# EAGLE schematic yusynth_vco (EAGLE 9.6.2)

## Sheet 1 of 5
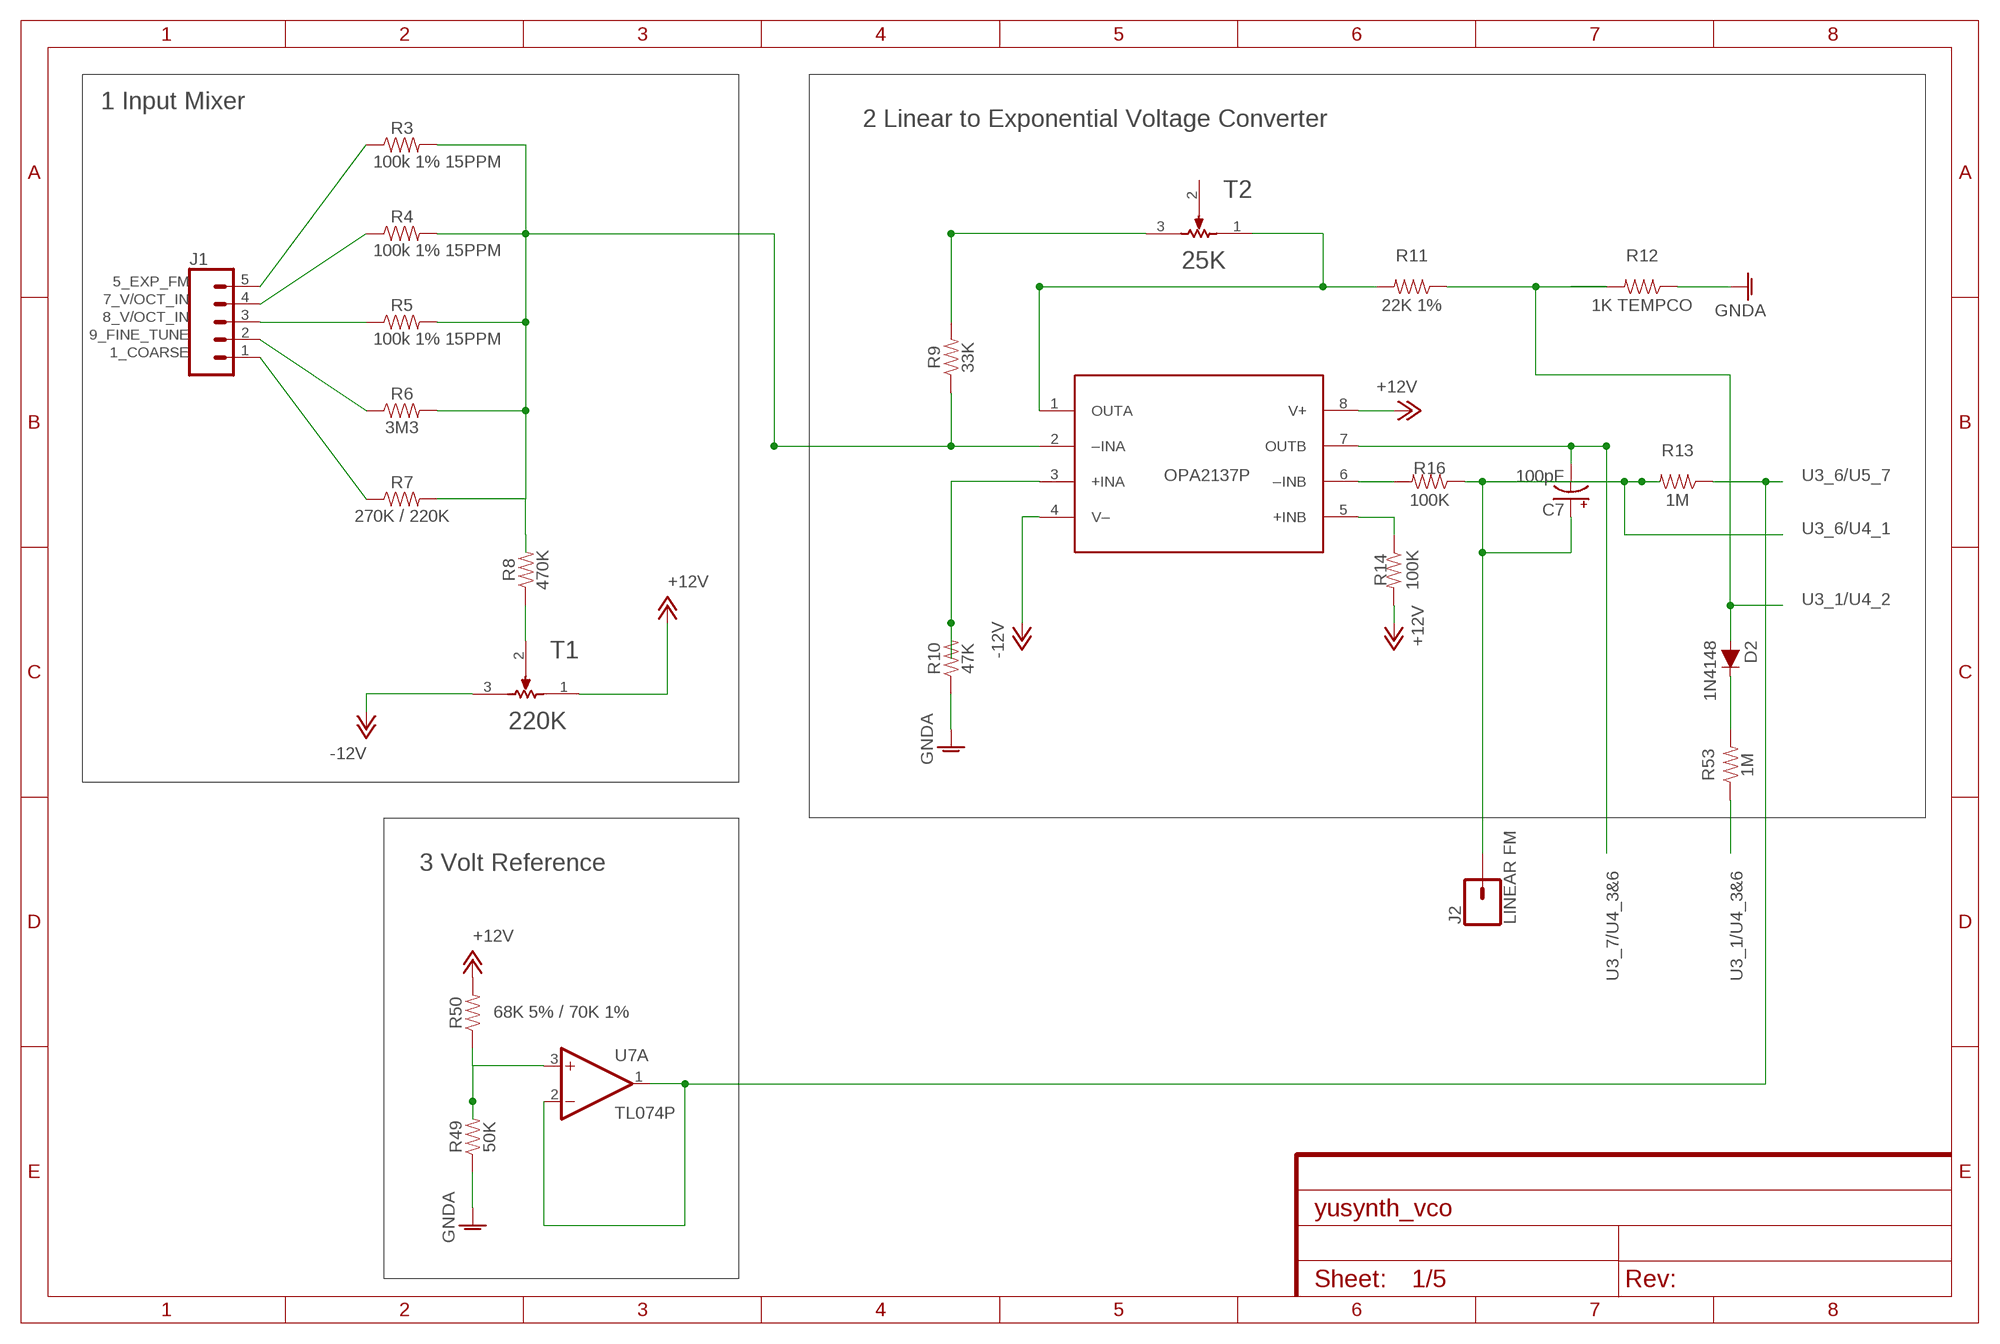
[diagram p0: schematic, sheet 1]

### Parts
C7  100pF  100UF-POLAR-RADIAL-2.5MM-25V-20%  [CPOL-RADIAL-2.5MM-6.5MM]
D2  1N4148  DIODE-1N4148  [DIODE-1N4148]
J1  CONN_05LOCK  [1X05_LOCK]
J2  LINEAR FM  CONN_01  [1X01]
R3  100k 1% 15PPM  100KOHM-HORIZ_KIT-1/4W-1%  [AXIAL-0.3-KIT]
R4  100k 1% 15PPM  100KOHM-HORIZ_KIT-1/4W-1%  [AXIAL-0.3-KIT]
R5  100k 1% 15PPM  100KOHM-HORIZ_KIT-1/4W-1%  [AXIAL-0.3-KIT]
R6  3M3  100KOHM-HORIZ_KIT-1/4W-1%  [AXIAL-0.3-KIT]
R7  270K / 220K  100KOHM-HORIZ_KIT-1/4W-1%  [AXIAL-0.3-KIT]
R8  470K  100KOHM-HORIZ_KIT-1/4W-1%  [AXIAL-0.3-KIT]
R9  33K  100KOHM-HORIZ_KIT-1/4W-1%  [AXIAL-0.3-KIT]
R10  47K  100KOHM-HORIZ_KIT-1/4W-1%  [AXIAL-0.3-KIT]
R11  22K 1%  100KOHM-HORIZ_KIT-1/4W-1%  [AXIAL-0.3-KIT]
R12  1K TEMPCO  100KOHM-HORIZ_KIT-1/4W-1%  [AXIAL-0.3-KIT]
R13  1M  100KOHM-HORIZ_KIT-1/4W-1%  [AXIAL-0.3-KIT]
R14  100K  100KOHM-HORIZ_KIT-1/4W-1%  [AXIAL-0.3-KIT]
R16  100K  100KOHM-HORIZ_KIT-1/4W-1%  [AXIAL-0.3-KIT]
R49  50K  100KOHM-HORIZ_KIT-1/4W-1%  [AXIAL-0.3-KIT]
R50  68K 5% / 70K 1%  100KOHM-HORIZ_KIT-1/4W-1%  [AXIAL-0.3-KIT]
R53  1M  100KOHM-HORIZ_KIT-1/4W-1%  [AXIAL-0.3-KIT]
T1  220K  BOURNS_3296W-1-103LFBOURNS_3296W-1-103LF_0_0  [BOURNS_3296W-1-103LF_0]
T2  22K  BOURNS_3296W-1-103LFBOURNS_3296W-1-103LF_0_0  [BOURNS_3296W-1-103LF_0]
U3  TEXAS_INSTRUMENTS_OPA2137PTEXAS_INSTRUMENTS_OPA2137P_0_0  [TEXAS_INSTRUMENTS_OPA2137P_0]
U7  TL074P  [DIL14]

### Nets
1_COARSE: J1.1 R7.P$1
5_EXP_FM: J1.5 R3.P$1
7_V/OCT_IN: J1.4 R4.P$1
8_V/OCT_IN: J1.3 R5.P$1
9_FINE_TUNE: J1.2 R6.P$1
+12V: R14.P$2 R50.P$2 T1.1(CCW) U3.8(V+) ; also sheet 2,3,4,5
-12V: T1.3(CW) U3.4(V–) ; also sheet 2,4,5
GNDA: R10.P$1 R12.P$1 R49.P$1 ; also sheet 2,3,4,5
N$2: R8.P$1 T1.2(S)
N$3: R10.P$2 U3.3(+INA)
N$4: R9.P$2 T2.3(CW)
N$5: R11.P$2 T2.1(CCW) U3.1(OUTA)
N$11: R49.P$2 R50.P$1 U7.3(A:+IN)
N$16: D2.C R53.P$2
N$47: R16.P$2 U3.6(–INB)
N$48: R14.P$1 U3.5(+INB)
N$55: R3.P$2 R4.P$2 R5.P$2 R6.P$2 R7.P$2 R8.P$2 R9.P$1 U3.2(–INA)
U3_1/U4_2: D2.A R11.P$1 R12.P$2 ; also sheet 2
U3_1/U4_3&6: R53.P$1 ; also sheet 2
U3_6/U4_1: C7.1(+) J2.1 R13.P$2 R16.P$1 ; also sheet 2
U3_6/U5_7: R13.P$1 U7.1(A:OUT) U7.2(A:-IN) ; also sheet 2
U3_7/U4_3&6: C7.2(-) U3.7(OUTB) ; also sheet 2
Unconnected: T2.2(S) U7.5(B:+IN) U7.6(B:-IN) U7.7(B:OUT) U7.8(C:OUT) U7.9(C:-IN) U7.10(C:+IN) U7.12(D:+IN) U7.13(D:-IN) U7.14(D:OUT)

### Notes on the sheet
- 1 Input Mixer
- 2 Linear to Exponential Voltage Converter
- 25K
- 220K
- 3 Volt Reference

## Sheet 2 of 5
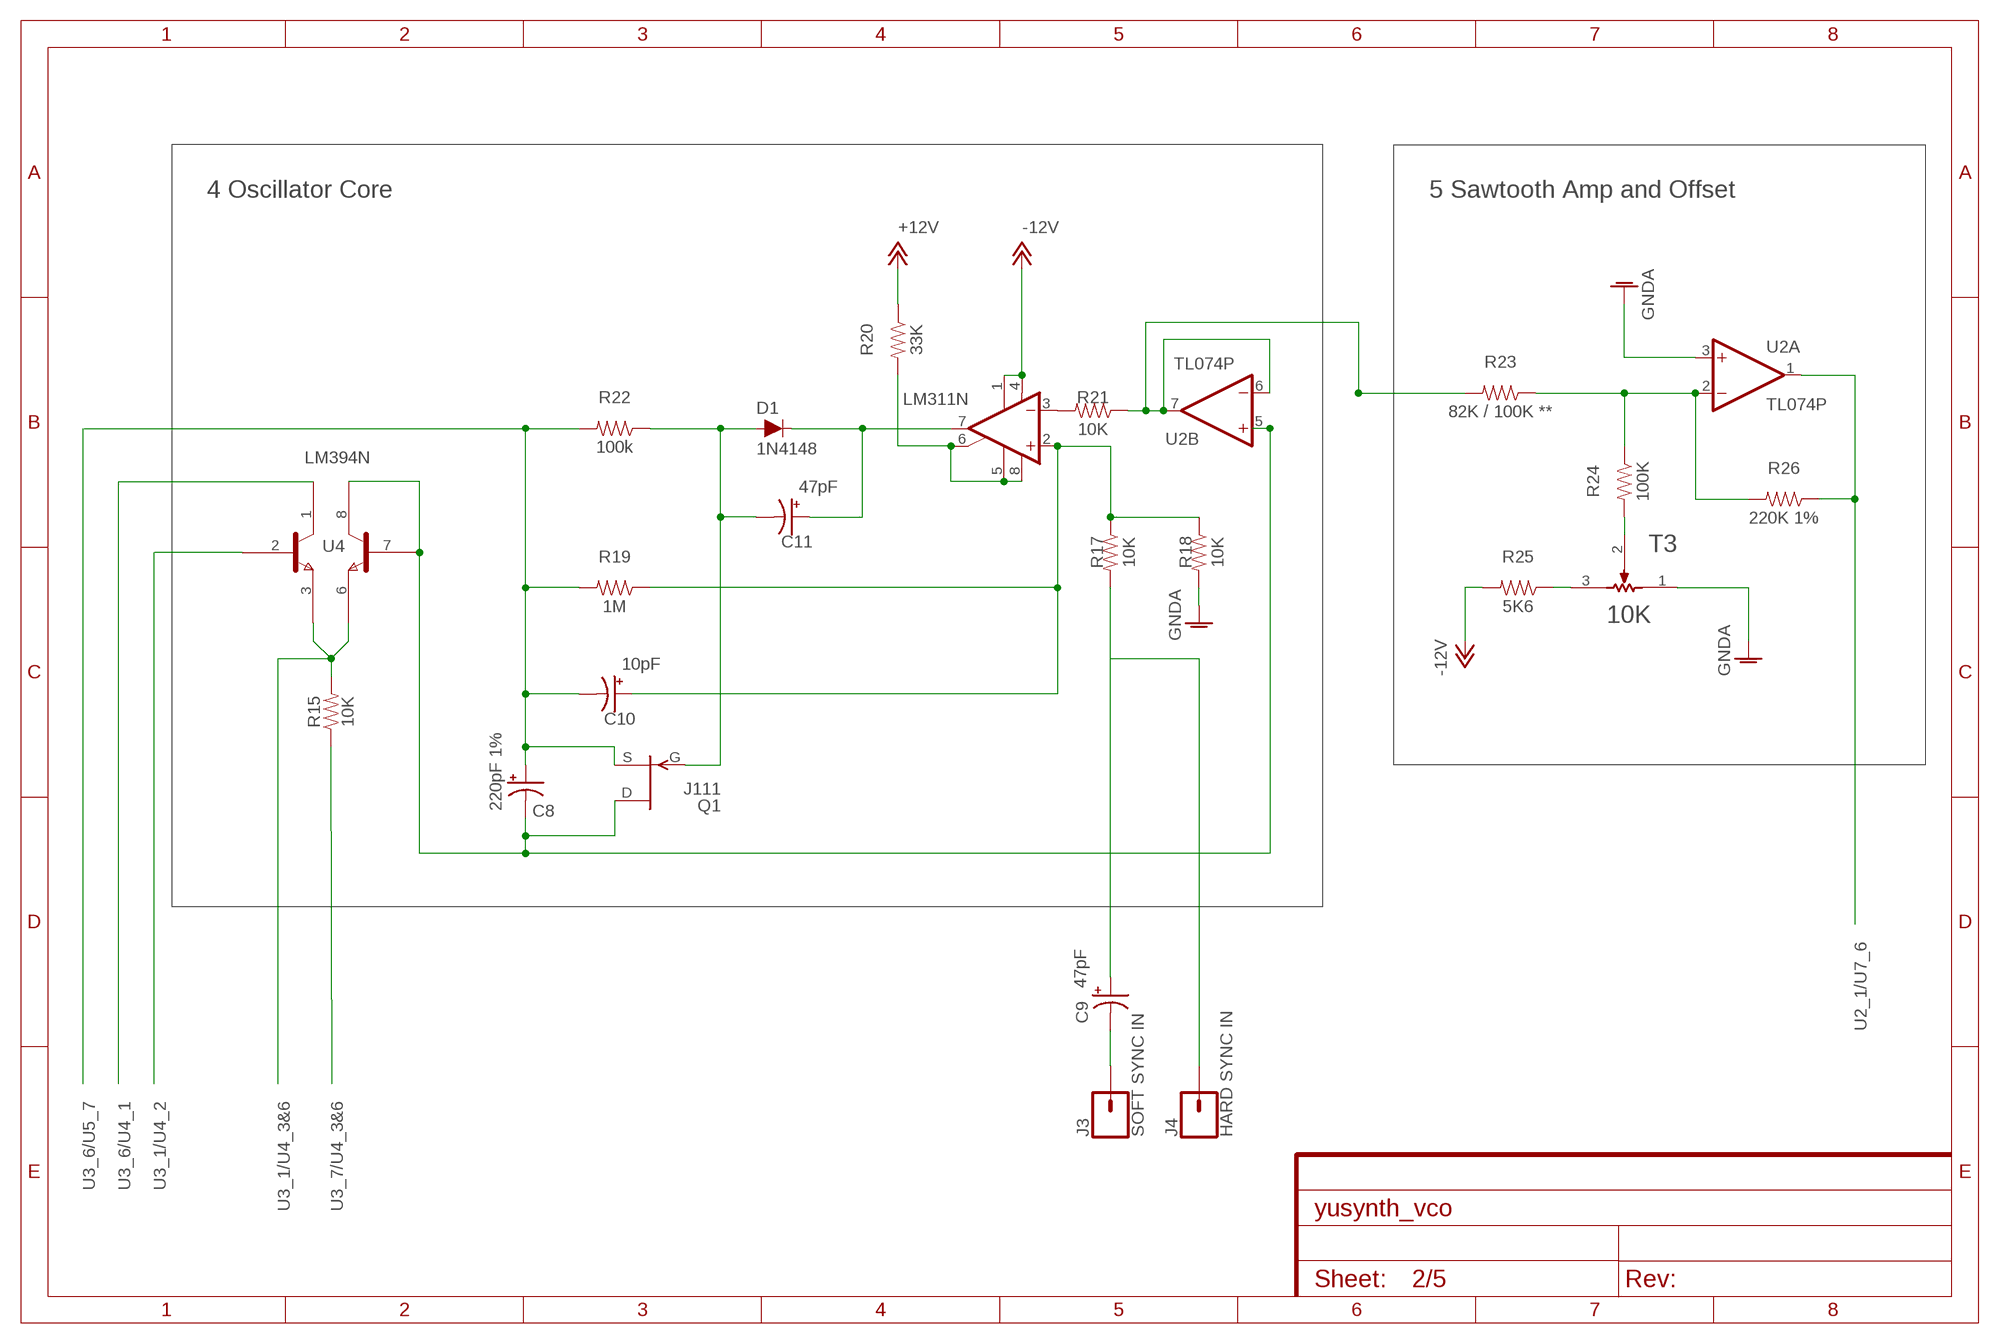
[diagram p1: schematic, sheet 2]

### Parts
C8  220pF 1%  100UF-POLAR-RADIAL-2.5MM-25V-20%  [CPOL-RADIAL-2.5MM-6.5MM]
C9  47pF  100UF-POLAR-RADIAL-2.5MM-25V-20%  [CPOL-RADIAL-2.5MM-6.5MM]
C10  10pF  100UF-POLAR-RADIAL-2.5MM-25V-20%  [CPOL-RADIAL-2.5MM-6.5MM]
C11  47pF  100UF-POLAR-RADIAL-2.5MM-25V-20%  [CPOL-RADIAL-2.5MM-6.5MM]
D1  1N4148  DIODE-1N4148  [DIODE-1N4148]
IC2  LM311N  [DIL08]
J3  SOFT SYNC IN  CONN_01  [1X01]
J4  HARD SYNC IN  CONN_01  [1X01]
Q1  J111  [TO92]
R15  10K  100KOHM-HORIZ_KIT-1/4W-1%  [AXIAL-0.3-KIT]
R17  10K  100KOHM-HORIZ_KIT-1/4W-1%  [AXIAL-0.3-KIT]
R18  10K  100KOHM-HORIZ_KIT-1/4W-1%  [AXIAL-0.3-KIT]
R19  1M  100KOHM-HORIZ_KIT-1/4W-1%  [AXIAL-0.3-KIT]
R20  33K  100KOHM-HORIZ_KIT-1/4W-1%  [AXIAL-0.3-KIT]
R21  10K  100KOHM-HORIZ_KIT-1/4W-1%  [AXIAL-0.3-KIT]
R22  100k  100KOHM-HORIZ_KIT-1/4W-1%  [AXIAL-0.3-KIT]
R23  82K / 100K **  100KOHM-HORIZ_KIT-1/4W-1%  [AXIAL-0.3-KIT]
R24  100K  100KOHM-HORIZ_KIT-1/4W-1%  [AXIAL-0.3-KIT]
R25  5K6  100KOHM-HORIZ_KIT-1/4W-1%  [AXIAL-0.3-KIT]
R26  220K 1%  100KOHM-HORIZ_KIT-1/4W-1%  [AXIAL-0.3-KIT]
T3  10K  BOURNS_3296W-1-103LFBOURNS_3296W-1-103LF_0_0  [BOURNS_3296W-1-103LF_0]
U2  TL074P  [DIL14]
U4  LM394N  [DIL08]

### Nets
+12V: R20.P$1 ; also sheet 1,3,4,5
-12V: IC2.1(GND) IC2.4(V-) R25.P$2 ; also sheet 1,4,5
GNDA: R18.P$2 T3.1(CCW) U2.3(A:+IN) ; also sheet 1,3,4,5
N$9: C8.2(-) Q1.3(D) U2.5(B:+IN) U4.7(B2) U4.8(C2)
N$10: C10.1(+) IC2.2(+IN) R17.P$1 R18.P$1 R19.P$1
N$12: IC2.5(ON) IC2.6(ON/STR) IC2.8(V+) R20.P$2
N$13: C11.2(-) D1.A Q1.1(G) R22.P$1
N$14: R23.P$2
N$17: C11.1(+) D1.C IC2.7(OUT)
N$18: R23.P$1 R24.P$1 R26.P$2 U2.2(A:-IN)
N$19: R24.P$2 T3.2(S)
N$20: R25.P$1 T3.3(CW)
N$50: R15.P$2 U4.3(E1) U4.6(E2)
N$51: C9.1(+) J4.1 R17.P$2
N$52: C9.2(-) J3.1
N$54: R21.P$1 U2.6(B:-IN) U2.7(B:OUT)
N$56: IC2.3(-IN) R21.P$2
N$57: C8.1(+) C10.2(-) Q1.2(S) R19.P$2 R22.P$2 U4.2(B1)
N$58: U4.1(C1)
U2_1/U7_6: R26.P$1 U2.1(A:OUT)
U3_7/U4_3&6: R15.P$1 ; also sheet 1
Unconnected: U2.8(C:OUT) U2.9(C:-IN) U2.10(C:+IN) U2.12(D:+IN) U2.13(D:-IN) U2.14(D:OUT)

### Notes on the sheet
- 4 Oscillator Core | 5 Sawtooth Amp and Offset
- 10K

## Sheet 3 of 5
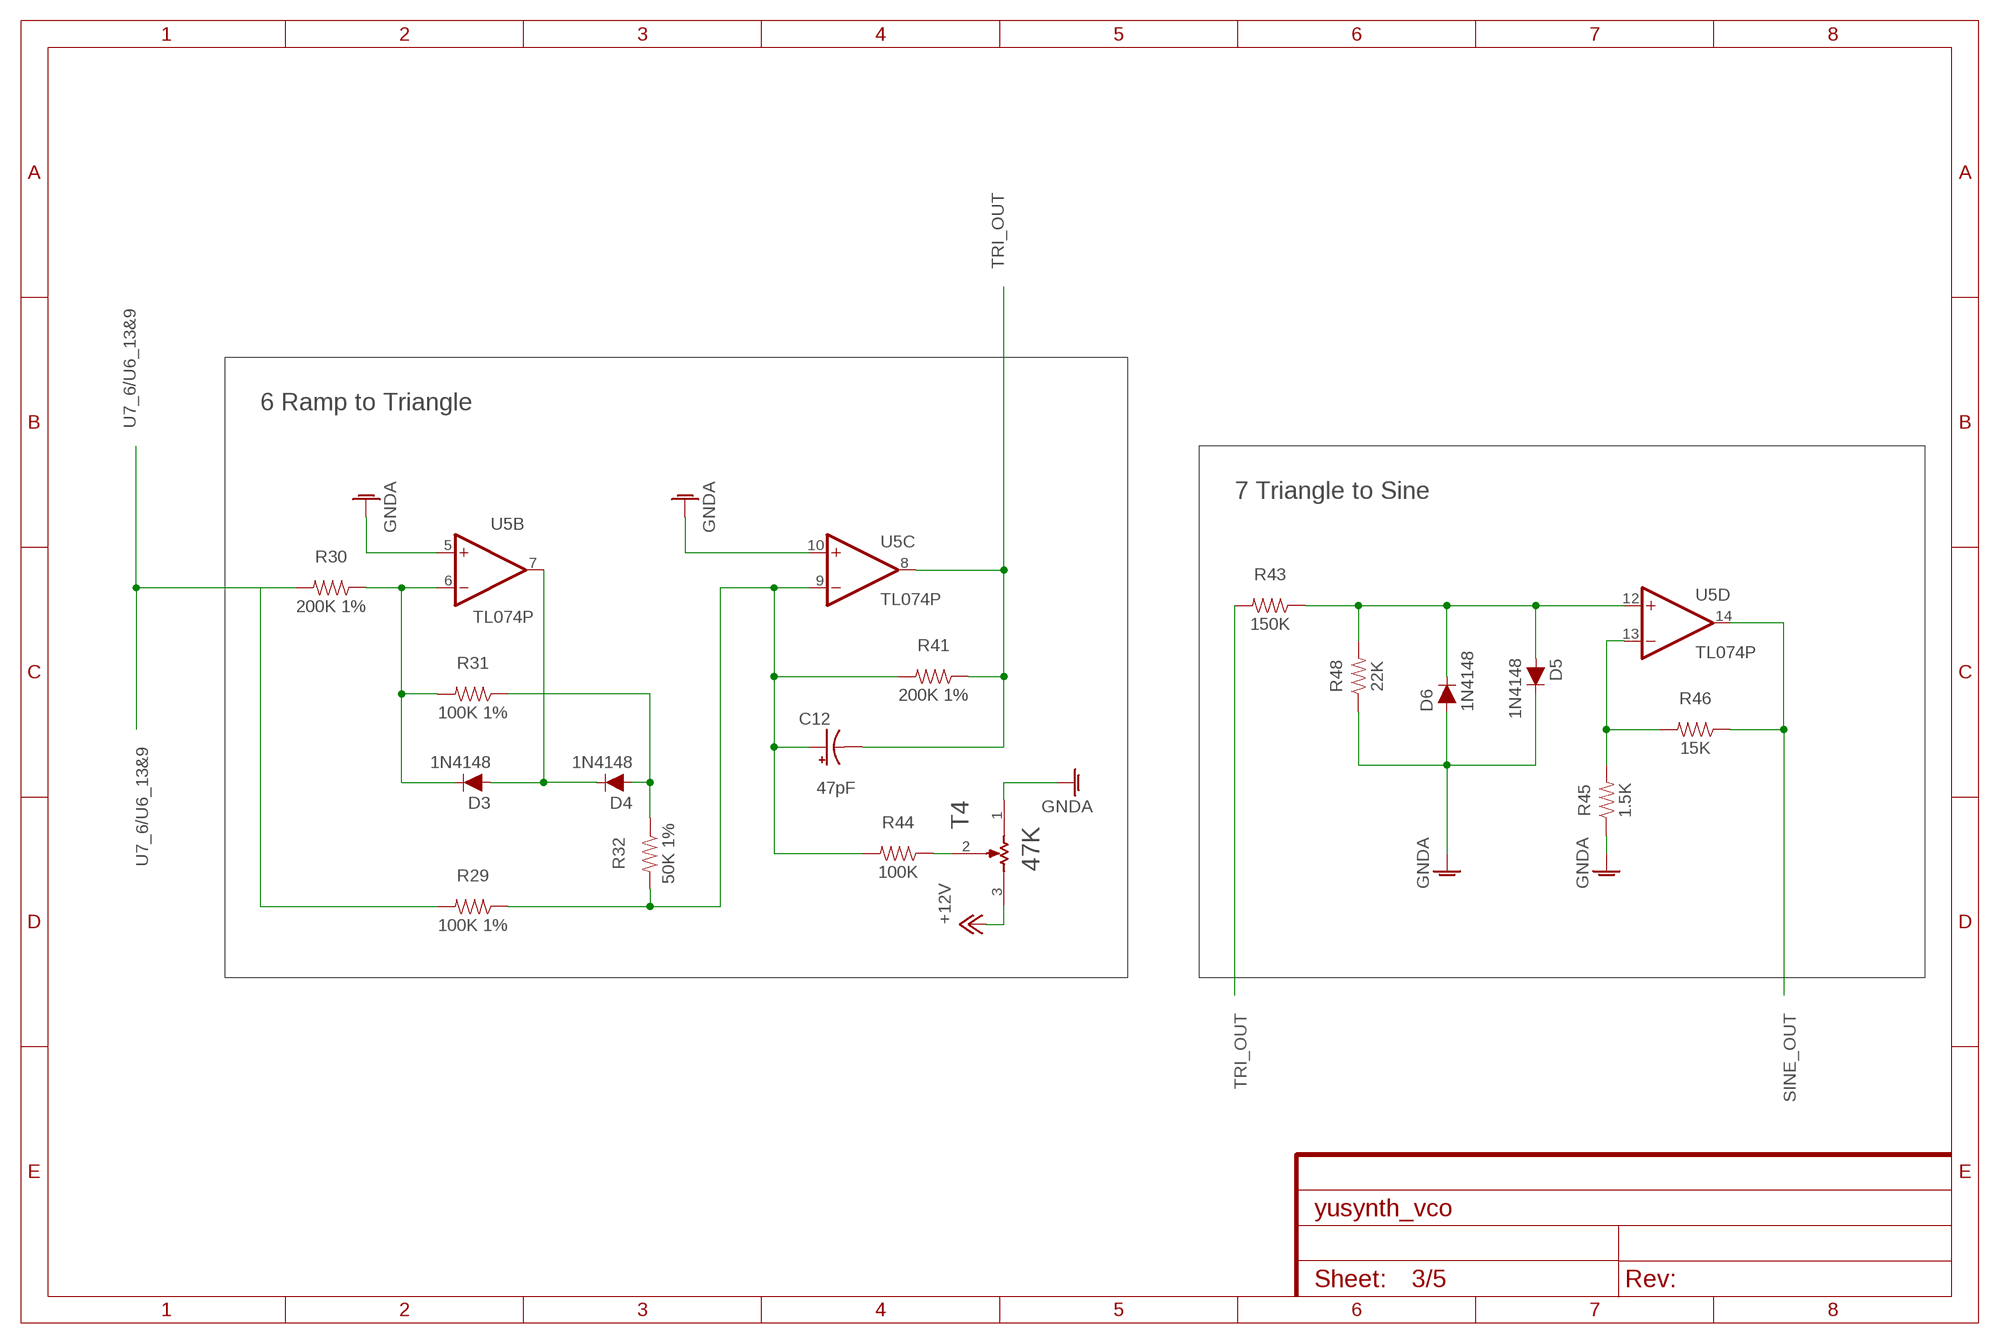
[diagram p2: schematic, sheet 3]

### Parts
C12  47pF  100UF-POLAR-RADIAL-2.5MM-25V-20%  [CPOL-RADIAL-2.5MM-6.5MM]
D3  1N4148  DIODE-1N4148  [DIODE-1N4148]
D4  1N4148  DIODE-1N4148  [DIODE-1N4148]
D5  1N4148  DIODE-1N4148  [DIODE-1N4148]
D6  1N4148  DIODE-1N4148  [DIODE-1N4148]
R29  100K 1%  100KOHM-HORIZ_KIT-1/4W-1%  [AXIAL-0.3-KIT]
R30  200K 1%  100KOHM-HORIZ_KIT-1/4W-1%  [AXIAL-0.3-KIT]
R31  100K 1%  100KOHM-HORIZ_KIT-1/4W-1%  [AXIAL-0.3-KIT]
R32  50K 1%  100KOHM-HORIZ_KIT-1/4W-1%  [AXIAL-0.3-KIT]
R41  200K 1%  100KOHM-HORIZ_KIT-1/4W-1%  [AXIAL-0.3-KIT]
R43  150K  100KOHM-HORIZ_KIT-1/4W-1%  [AXIAL-0.3-KIT]
R44  100K  100KOHM-HORIZ_KIT-1/4W-1%  [AXIAL-0.3-KIT]
R45  1.5K  100KOHM-HORIZ_KIT-1/4W-1%  [AXIAL-0.3-KIT]
R46  15K  100KOHM-HORIZ_KIT-1/4W-1%  [AXIAL-0.3-KIT]
R48  22K  100KOHM-HORIZ_KIT-1/4W-1%  [AXIAL-0.3-KIT]
T4  10K  BOURNS_3296W-1-103LFBOURNS_3296W-1-103LF_0_0  [BOURNS_3296W-1-103LF_0]
U5  TL074P  [DIL14]

### Nets
+12V: T4.3(CW) ; also sheet 1,2,4,5
GNDA: D5.C D6.A R45.P$1 R48.P$1 T4.1(CCW) U5.5(B:+IN) U5.10(C:+IN) ; also sheet 1,2,4,5
N$21: D4.A R31.P$1 R32.P$1
N$22: D3.A D4.C U5.7(B:OUT)
N$24: D3.C R30.P$1 R31.P$2 U5.6(B:-IN)
N$25: C12.1(+) R29.P$1 R32.P$2 R41.P$2 R44.P$2 U5.9(C:-IN)
N$27: R44.P$1 T4.2(S)
N$29: R45.P$2 R46.P$2 U5.13(D:-IN)
N$30: D5.A D6.C R43.P$1 R48.P$2 U5.12(D:+IN)
SINE_OUT: R46.P$1 U5.14(D:OUT)
TRI_OUT: C12.2(-) R41.P$1 R43.P$2 U5.8(C:OUT) ; also sheet 4
U7_6/U6_13&9: R29.P$2 R30.P$2 ; also sheet 4
Unconnected: U5.1(A:OUT) U5.2(A:-IN) U5.3(A:+IN)

### Notes on the sheet
- 6 Ramp to Triangle
- 7 Triangle to Sine
- 47K

## Sheet 4 of 5
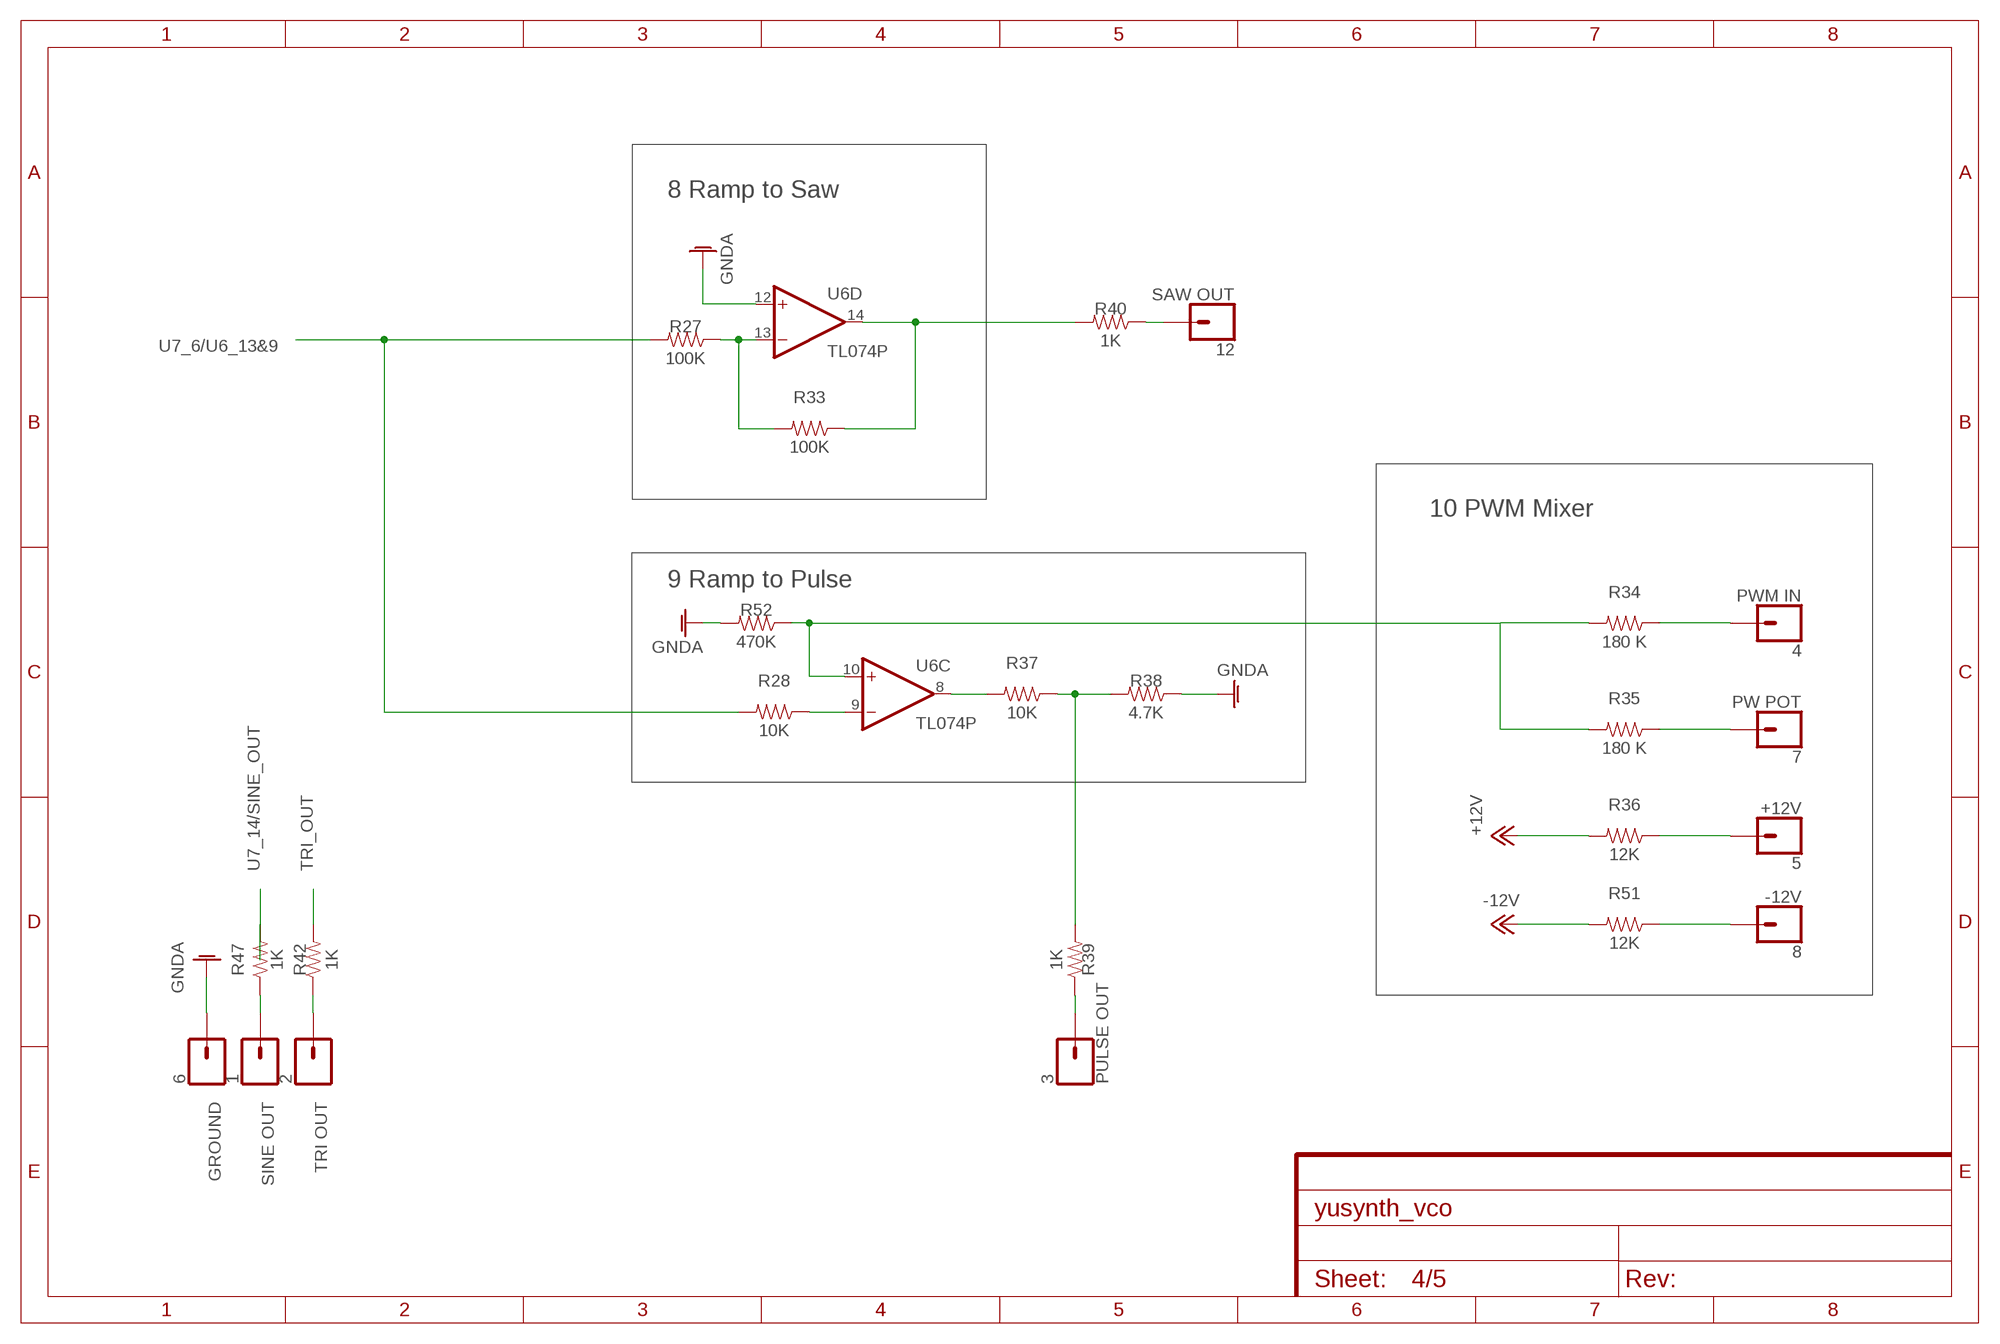
[diagram p3: schematic, sheet 4]

### Parts
1  SINE OUT  CONN_01  [1X01]
2  TRI OUT  CONN_01  [1X01]
3  PULSE OUT  CONN_01  [1X01]
4  PWM IN  CONN_01  [1X01]
5  +12V  CONN_01  [1X01]
6  GROUND  CONN_01  [1X01]
7  PW POT  CONN_01  [1X01]
8  -12V  CONN_01  [1X01]
12  SAW OUT  CONN_01  [1X01]
R27  100K  100KOHM-HORIZ_KIT-1/4W-1%  [AXIAL-0.3-KIT]
R28  10K  100KOHM-HORIZ_KIT-1/4W-1%  [AXIAL-0.3-KIT]
R33  100K  100KOHM-HORIZ_KIT-1/4W-1%  [AXIAL-0.3-KIT]
R34  180 K  100KOHM-HORIZ_KIT-1/4W-1%  [AXIAL-0.3-KIT]
R35  180 K  100KOHM-HORIZ_KIT-1/4W-1%  [AXIAL-0.3-KIT]
R36  12K  100KOHM-HORIZ_KIT-1/4W-1%  [AXIAL-0.3-KIT]
R37  10K  100KOHM-HORIZ_KIT-1/4W-1%  [AXIAL-0.3-KIT]
R38  4.7K  100KOHM-HORIZ_KIT-1/4W-1%  [AXIAL-0.3-KIT]
R39  1K  100KOHM-HORIZ_KIT-1/4W-1%  [AXIAL-0.3-KIT]
R40  1K  100KOHM-HORIZ_KIT-1/4W-1%  [AXIAL-0.3-KIT]
R42  1K  100KOHM-HORIZ_KIT-1/4W-1%  [AXIAL-0.3-KIT]
R47  1K  100KOHM-HORIZ_KIT-1/4W-1%  [AXIAL-0.3-KIT]
R51  12K  100KOHM-HORIZ_KIT-1/4W-1%  [AXIAL-0.3-KIT]
R52  470K  100KOHM-HORIZ_KIT-1/4W-1%  [AXIAL-0.3-KIT]
U6  TL074P  [DIL14]

### Nets
+12V: R36.P$2 ; also sheet 1,2,3,5
-12V: R51.P$2 ; also sheet 1,2,5
GNDA: 6.1 R38.P$1 R52.P$2 U6.12(D:+IN) ; also sheet 1,2,3,5
N$31: 1.1 R47.P$1
N$32: 2.1 R42.P$1
N$33: R33.P$1 R40.P$2 U6.14(D:OUT)
N$34: R28.P$1 U6.9(C:-IN)
N$35: R34.P$2 R35.P$2 R52.P$1 U6.10(C:+IN)
N$36: R37.P$1 R38.P$2 R39.P$2
N$37: R37.P$2 U6.8(C:OUT)
N$38: 3.1 R39.P$1
N$39: 4.1 R34.P$1
N$40: 7.1 R35.P$1
N$41: 5.1 R36.P$1
N$42: 8.1 R51.P$1
N$46: 12.1 R40.P$1
N$53: R27.P$1 R33.P$2 U6.13(D:-IN)
TRI_OUT: R42.P$2 ; also sheet 3
U7_6/U6_13&9: R27.P$2 R28.P$2 ; also sheet 3
U7_14/SINE_OUT: R47.P$2
Unconnected: U6.1(A:OUT) U6.2(A:-IN) U6.3(A:+IN) U6.5(B:+IN) U6.6(B:-IN) U6.7(B:OUT)

### Notes on the sheet
- 8 Ramp to Saw
- 10 PWM Mixer
- 9 Ramp to Pulse

## Sheet 5 of 5
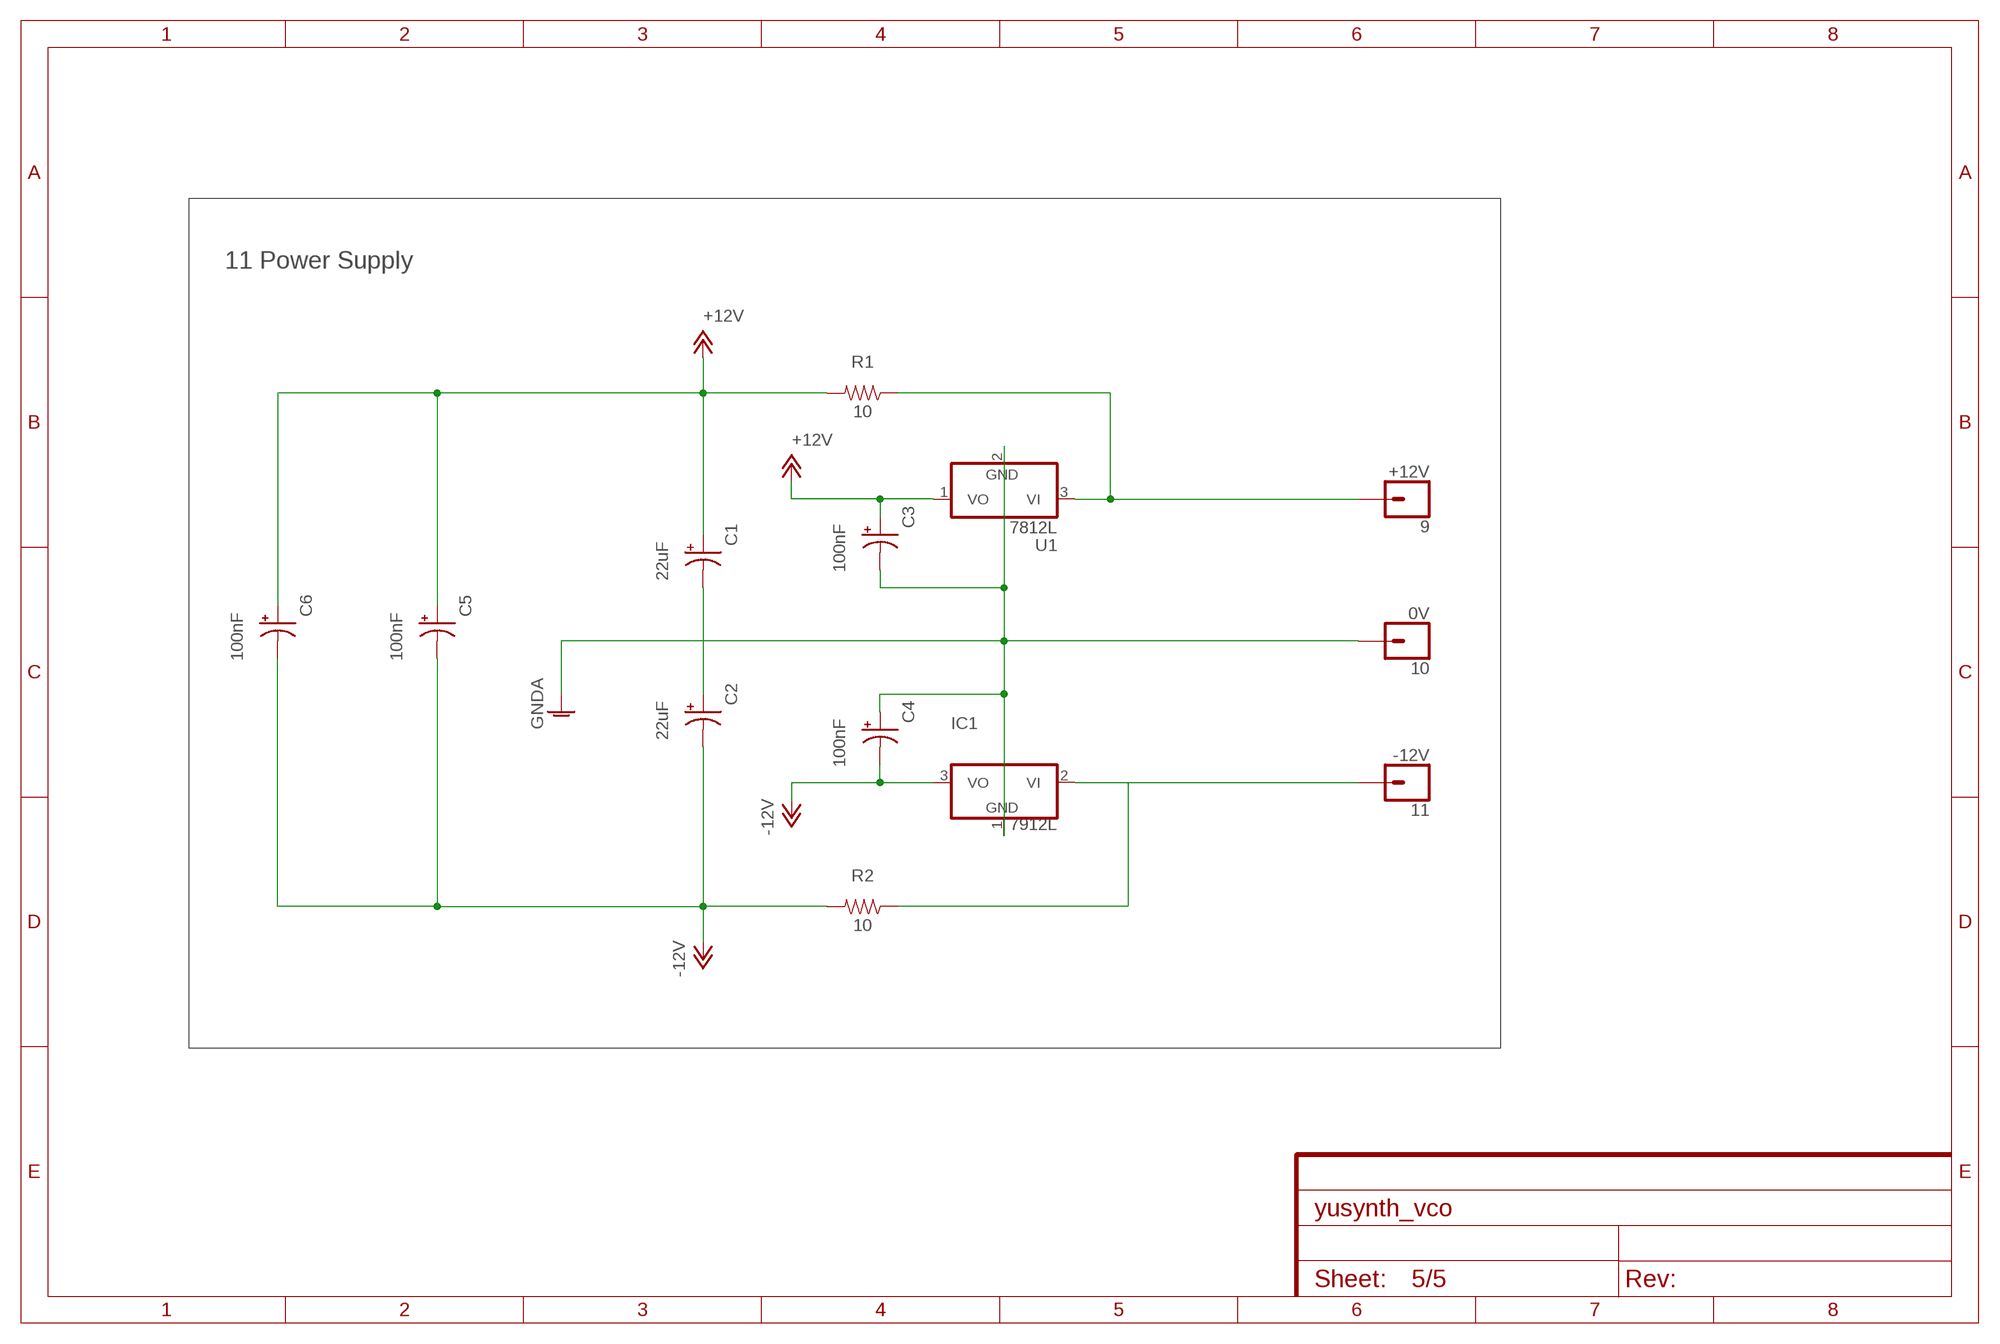
[diagram p4: schematic, sheet 5]

### Parts
9  +12V  CONN_01  [1X01]
10  0V  CONN_01  [1X01]
11  -12V  CONN_01  [1X01]
C1  22uF  100UF-POLAR-RADIAL-2.5MM-25V-20%  [CPOL-RADIAL-2.5MM-6.5MM]
C2  22uF  100UF-POLAR-RADIAL-2.5MM-25V-20%  [CPOL-RADIAL-2.5MM-6.5MM]
C3  100nF  100UF-POLAR-RADIAL-2.5MM-25V-20%  [CPOL-RADIAL-2.5MM-6.5MM]
C4  100nF  100UF-POLAR-RADIAL-2.5MM-25V-20%  [CPOL-RADIAL-2.5MM-6.5MM]
C5  100nF  100UF-POLAR-RADIAL-2.5MM-25V-20%  [CPOL-RADIAL-2.5MM-6.5MM]
C6  100nF  100UF-POLAR-RADIAL-2.5MM-25V-20%  [CPOL-RADIAL-2.5MM-6.5MM]
IC1  7912L  [TO92]
R1  10  100KOHM-HORIZ_KIT-1/4W-1%  [AXIAL-0.3-KIT]
R2  10  100KOHM-HORIZ_KIT-1/4W-1%  [AXIAL-0.3-KIT]
U1  7812L  [TO92]

### Nets
+12V: C1.1(+) C3.1(+) C5.1(+) C6.1(+) R1.P$2 U1.1(VO) ; also sheet 1,2,3,4
-12V: C2.2(-) C4.2(-) C5.2(-) C6.2(-) IC1.3(VO) R2.P$2 ; also sheet 1,2,4
GNDA: 10.1 C3.2(-) C4.1(+) IC1.1(GND) U1.2(GND) ; also sheet 1,2,3,4
N$43: 9.1 R1.P$1 U1.3(VI)
N$44: 11.1 IC1.2(VI) R2.P$1
N$45: C1.2(-) C2.1(+)

### Notes on the sheet
- 11 Power Supply
- 7912L

## Power pins joined to a net without a drawn wire
V+: U2.4(P:V+) U5.4(P:V+) U6.4(P:V+) U7.4(P:V+)
V-: U2.11(P:V-) U5.11(P:V-) U6.11(P:V-) U7.11(P:V-)

## Library data of the parts
1-12 J2-J4 = SparkFun-Connectors:CONN_01: Single connection point. Often used as Generic Header-pin footprint for 0.1 inch spaced/style header connections On any of the 0.1 inch spaced packages, you can populate with these: Break Away Headers - Straight <https://www.sparkfun.com/products/116> (PRT-00116) Break Away Male Headers - Right Angle <https://www.sparkfun.com/products/553> (PRT-00553) Female Headers <https://www.sparkfun.com/products/115> (PRT-00115) Break Away Headers - Machine Pin <https://www.sparkfun.com/products/117> (PRT-00117) Break Away Female Headers - Swiss Machine Pin <https://www.sparkfun.com/products/743> (PRT-00743) This device is also useful as a general connection point to wire up your design to another part of your project. Our various solder wires solder well into these plated through hole pads. Hook-Up Wire - Assortment (Stranded, 22 AWG) <https://www.sparkfun.com/products/11375> (PRT-11375) Hook-Up Wire - Assortment (Solid Core, 22 AWG) <https://www.sparkfun.com/products/11367> (PRT-11367) View the entire wire category on our website here <https://www.sparkfun.com/categories/141> Special notes: SMTSO-256-ET is a "flush mount" nut for a 4-40 screw. We mostly use this on specialty testbeds; it is a nice way to connect hardware to your PCB at an adjustable hieght. Also note, the SNAP packages are for using a snappable style connector. We sell a baggie of snaps and they are also used on two LilyPad designs: Snap Assortment - 30 pack (male and female) <https://www.sparkfun.com/products/11347> (DEV-11347) LilyPad Arduino SimpleSnap <https://www.sparkfun.com/products/10941> (DEV-10941) LilyPad SimpleSnap Protoboard <https://www.sparkfun.com/products/10940> (DEV-10940)
C1-C12 = SparkFun-Capacitors:100UF-POLAR: 100µF polarized capacitors A capacitor is a passive two-terminal electrical component used to store electrical energy temporarily in an electric field.; PROD_ID: CAP-08439; VALUE: 100uF
D1-D6 = SparkFun-DiscreteSemi:DIODE: Diode These are standard reverse protection diodes and small signal diodes. SparkFun Products: SparkFun SparkPunk Sound Kit <https://www.sparkfun.com/products/11177> SparkFun ESP8266 Thing <https://www.sparkfun.com/products/13231>; PROD_ID: DIO-08378; VALUE: 200mA/100V/1V
IC1 = linear:79*: Negative VOLTAGE REGULATOR
IC2 = linear:LM311: COMPARATOR
J1 = SparkFun-Connectors:CONN_05: Multi connection point. Often used as Generic Header-pin footprint for 0.1 inch spaced/style header connections On any of the 0.1 inch spaced packages, you can populate with these: Break Away Headers - Straight <https://www.sparkfun.com/products/116> (PRT-00116) Break Away Male Headers - Right Angle <https://www.sparkfun.com/products/553> (PRT-00553) Female Headers <https://www.sparkfun.com/products/115> (PRT-00115) Break Away Headers - Machine Pin <https://www.sparkfun.com/products/117> (PRT-00117) Break Away Female Headers - Swiss Machine Pin <https://www.sparkfun.com/products/743> (PRT-00743) For SCREWTERMINALS and SPRING TERMINALS visit here: Screw Terimnals on SparkFun.com <https://www.sparkfun.com/search/results?term=Screw+Terminals> (5mm/3.5mm/2.54mm spacing) This device is also useful as a general connection point to wire up your design to another part of your project. Our various solder wires solder well into these plated through hole pads. Hook-Up Wire - Assortment (Stranded, 22 AWG) <https://www.sparkfun.com/products/11375> (PRT-11375) Hook-Up Wire - Assortment (Solid Core, 22 AWG) <https://www.sparkfun.com/products/11367> (PRT-11367) View the entire wire category on our website here <https://www.sparkfun.com/categories/141> Special notes: Molex polarized connector foot print use with SKU : PRT-08231 with associated crimp pins and housings. 1MM SMD Version SKU: PRT-10208
Q1 = J111:J111: J11x N-channel JFET Check prices <https://pricing.snapeda.com/parts/J111/ON%20Semiconductor/view-part?ref=eda>; AVAILABILITY: Good; DESCRIPTION: JFET N-Channel 35V 625mW Through Hole TO-92-3; MF: ON Semiconductor; MP: J111; PACKAGE: TO-92-3 ON Semiconductor; PRICE: None; PURCHASE-URL: https://pricing.snapeda.com/search/part/J111/?ref=eda
R1-R21 R23-R53 = SparkFun-Resistors:100KOHM: 100kΩ resistor A resistor is a passive two-terminal electrical component that implements electrical resistance as a circuit element. Resistors act to reduce current flow, and, at the same time, act to lower voltage levels within circuits. - Wikipedia; PROD_ID: RES-12184; VALUE: 100k
R22 = SparkFun-Resistors:100KOHM: 100kΩ resistor A resistor is a passive two-terminal electrical component that implements electrical resistance as a circuit element. Resistors act to reduce current flow, and, at the same time, act to lower voltage levels within circuits. - Wikipedia; PROD_ID: RES-12184
T1-T4 = Bourns - 3296W-1-103LF:BOURNS_3296W-1-103LF: RES-POT-3; CASE_CODE_IMPERIAL: 0603; CASE_CODE_METRIC: 1608; CASE_PACKAGE: 0603; CIIVA_IDS: 957529; COMPONENT_LINK_1_DESCRIPTION: Manufacturer URL; COMPONENT_LINK_1_URL: http://www.bourns.com/; DATASHEET: http://www.bourns.com/docs/Product-Datasheets/3296.pdf; DATASHEET_VERSION: May-16; FOOTPRINT_VARIANT_NAME_0: Manufacturer Recommended; HEIGHT: 0.45 mm; IMPORTED: yes; IMPORTED_FROM: vault; IMPORT_TS: 1521842853; LENGTH: 1.55 mm; MAX_OPERATING_TEMPERATURE: 155 degC; MF: Bourns; MIN_OPERATING_TEMPERATURE: -55 degC; MOUNT: Surface Mount; MPN: 3296W-1-103LF; PACKAGE: 3296W; PACKAGE_DESCRIPTION: 3-Pin Through Hole Device, Body 9.53 x 4.83 mm, Pitch 2.54 mm; PACKAGE_QUANTITY: 5000; PACKAGING: Tape and Reel; PINS: 2; POWER_RATING: 100 mW; PREFIX: VR; RADIATION_HARDENING: No; REACH_SVHC: Unknown; RELEASE_DATE: 1475044606; RESISTANCE: 120 Ohm; RO_HSCOMPLIANT: true; TOLERANCE: 1%; TYPE_RESISTOR: Thick Film; VAULT_GUID: 9CC99A9C-0E41-4CBF-A7EA-3361F1ADF078; VAULT_REVISION: 5A03C5DF-B4E4-4735-89AF-3DDB6A1A86E6; VOLTAGE_RATING: 75 V; WEIGHT: 7.1E-05 oz; WIDTH: 0.85 mm
U1 = linear:78*: Positive VOLTAGE REGULATOR Source: http://cache.national.com/ds/LM/LM78L05.pdf http://www.fairchildsemi.com/ds/LM/LM7805.pdf
U2 U5-U7 = linear:TL074: OP AMP
U3 = Texas Instruments - OPA2137P:TEXAS_INSTRUMENTS_OPA2137P: TI-AMP-D6-2-8_B; CIIVA_IDS: 1321986; CMRR_MIND_B: 76; CODE__JEDEC: MS-001; COMPONENT_LINK_1_DESCRIPTION: Manufacturer URL; COMPONENT_LINK_1_URL: http://www.ti.com/; COMPONENT_LINK_3_DESCRIPTION: Package Specification; COMPONENT_LINK_3_URL: http://www.ti.com/litv/pdf/mpdi001b; DATASHEET: http://www.ti.com/lit/ds/symlink/opa2137.pdf; DATASHEET_VERSION: SBOS089; FOOTPRINT_VARIANT_NAME_0: Manufacturer Recommended; GBW_TYP_MHZ: 1; IIB_MAXP_A: 100; IMPORTED: yes; IMPORTED_FROM: vault; IMPORT_TS: 1521851317; IQ_PER_CHANNELMAXMA: 0.27; MF: Texas Instruments; MOUNTING_TECHNOLOGY: Through Hole; MPN: OPA2137P; NUMBER_OF_CHANNELS: 2; OFFSET_DRIFTTYPUVC: 15; PACKAGE: P0008A; PACKAGE_DESCRIPTION: 8-Pin Plastic In-Line, Body 9.59 x 6.35 mm, Pitch 2.54 mm; PACKAGE_VERSION: 4040082/E, 04/2010; PREFIX: U; RATING: Catalog; RELEASE_DATE: 1464163534; ROHS: Yes; SLEW_RATETYPVUS: 3.5; SUB_FAMILY: General Purpose Amplifier, High Supply Voltage Amplifier (>=30V), Low Power Amp (<=500uA); TOTAL_SUPPLY_VOLTAGEMAX5V_IS_5__5V_IS_10: 36; TOTAL_SUPPLY_VOLTAGEMIN5V_IS_5__5V_IS_10: 4.5; VAULT_GUID: C1108F06-5AE1-47BF-BE73-375AFD74390E; VAULT_REVISION: 2CB02EB6-2CC2-4298-823B-6F4114FD52DD; VIO_25CMAXMV: 3; VN_AT_1KHZTYPNVRTHZ: 45
U4 = synthdiy:LM394: National Dual TRANSISTOR